# Altium schematic sheet EnergyHarvestingBoard.SchDoc
size A2; SheetNumber: 1; SheetTotal: 1
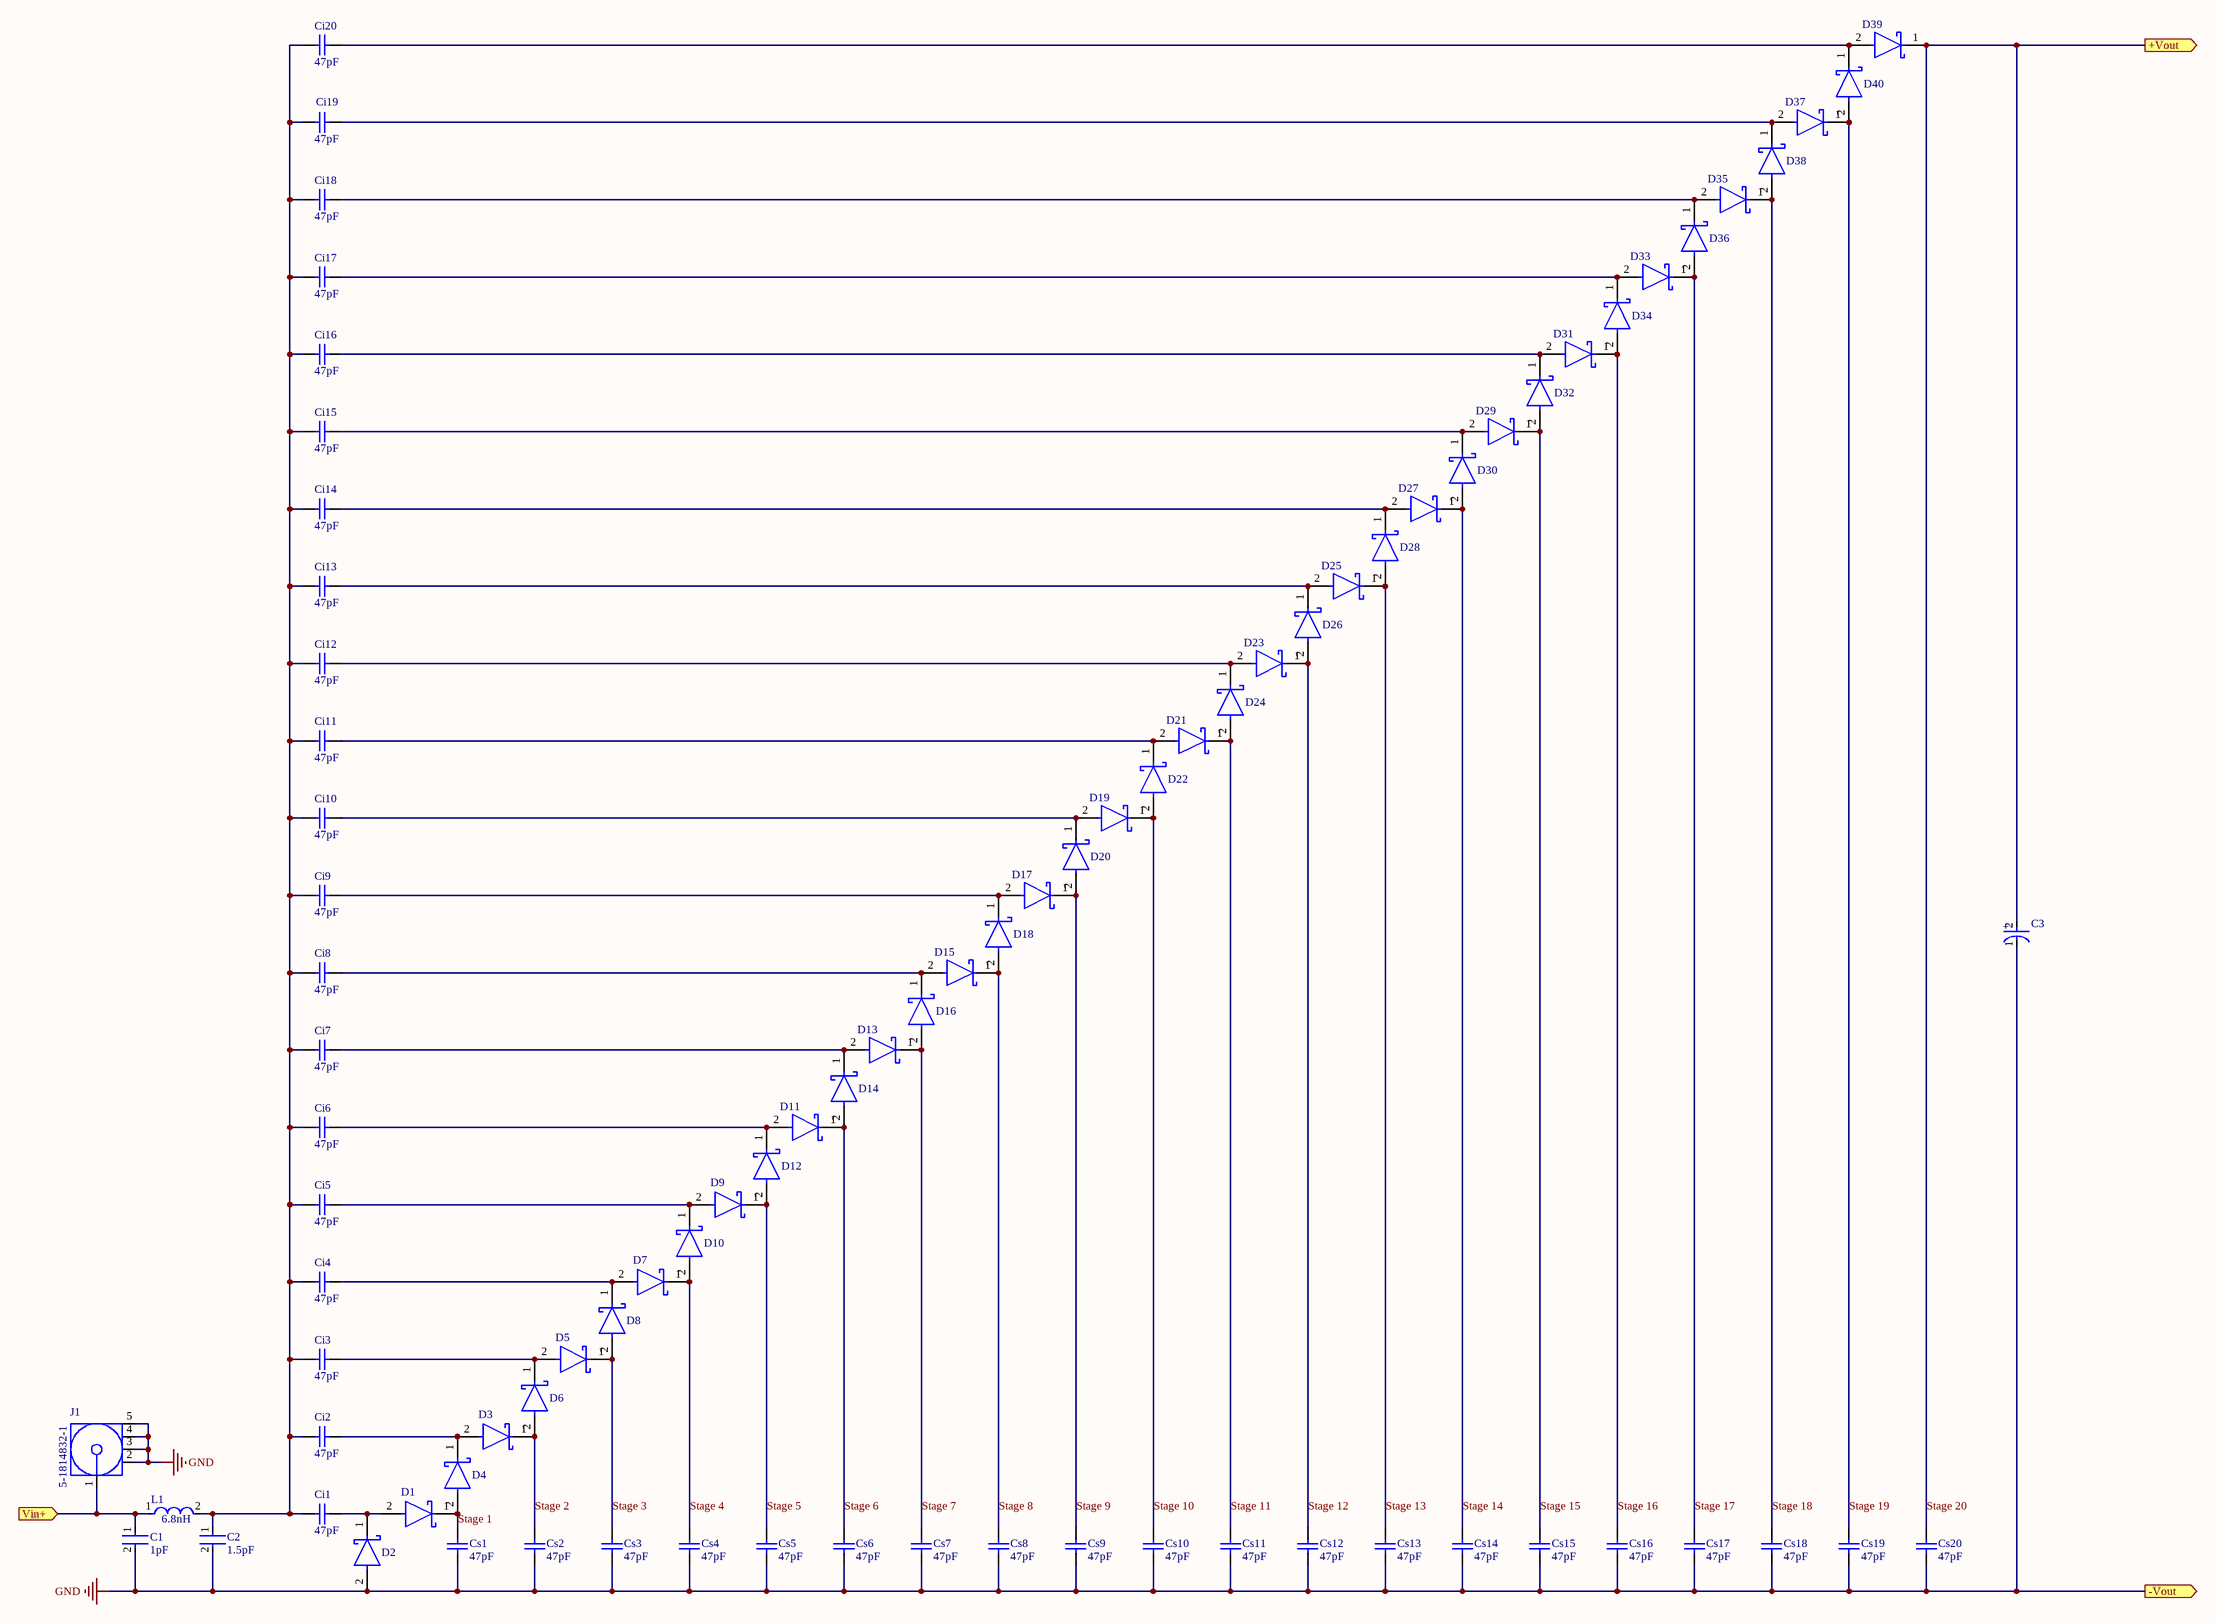
[diagram p0: EnergyHarvestingBoard.SchDoc]

## Parts
C1  1pF  [FP-CBR04C-MFG]
C2  1.5pF  [FP-CBR04C-MFG]
C3  EEUEB1JR47S  [FP-RAD-TH-D_5_0_5-L_11_1-MFG]  (value not drawn)
Ci1  47pF  [CAPC1005X56X25NL10T15]
Ci2  47pF  [CAPC1005X56X25NL10T15]
Ci3  47pF  [CAPC1005X56X25NL10T15]
Ci4  47pF  [CAPC1005X56X25NL10T15]
Ci5  47pF  [CAPC1005X56X25NL10T15]
Ci6  47pF  [CAPC1005X56X25NL10T15]
Ci7  47pF  [CAPC1005X56X25NL10T15]
Ci8  47pF  [CAPC1005X56X25NL10T15]
Ci9  47pF  [CAPC1005X56X25NL10T15]
Ci10  47pF  [CAPC1005X56X25NL10T15]
Ci11  47pF  [CAPC1005X56X25NL10T15]
Ci12  47pF  [CAPC1005X56X25NL10T15]
Ci13  47pF  [CAPC1005X56X25NL10T15]
Ci14  47pF  [CAPC1005X56X25NL10T15]
Ci15  47pF  [CAPC1005X56X25NL10T15]
Ci16  47pF  [CAPC1005X56X25NL10T15]
Ci17  47pF  [CAPC1005X56X25NL10T15]
Ci18  47pF  [CAPC1005X56X25NL10T15]
Ci19  47pF  [CAPC1005X56X25NL10T15]
Ci20  47pF  [CAPC1005X56X25NL10T15]
Cs1  47pF  [CAPC1005X56X25NL10T15]
Cs2  47pF  [CAPC1005X56X25NL10T15]
Cs3  47pF  [CAPC1005X56X25NL10T15]
Cs4  47pF  [CAPC1005X56X25NL10T15]
Cs5  47pF  [CAPC1005X56X25NL10T15]
Cs6  47pF  [CAPC1005X56X25NL10T15]
Cs7  47pF  [CAPC1005X56X25NL10T15]
Cs8  47pF  [CAPC1005X56X25NL10T15]
Cs9  47pF  [CAPC1005X56X25NL10T15]
Cs10  47pF  [CAPC1005X56X25NL10T15]
Cs11  47pF  [CAPC1005X56X25NL10T15]
Cs12  47pF  [CAPC1005X56X25NL10T15]
Cs13  47pF  [CAPC1005X56X25NL10T15]
Cs14  47pF  [CAPC1005X56X25NL10T15]
Cs15  47pF  [CAPC1005X56X25NL10T15]
Cs16  47pF  [CAPC1005X56X25NL10T15]
Cs17  47pF  [CAPC1005X56X25NL10T15]
Cs18  47pF  [CAPC1005X56X25NL10T15]
Cs19  47pF  [CAPC1005X56X25NL10T15]
Cs20  47pF  [CAPC1005X56X25NL10T15]
D1  CDBQR0130L  [FP-0402-SOD-923F-MFG]  (value not drawn)
D2  CDBQR0130L  [FP-0402-SOD-923F-MFG]  (value not drawn)
D3  CDBQR0130L  [FP-0402-SOD-923F-MFG]  (value not drawn)
D4  CDBQR0130L  [FP-0402-SOD-923F-MFG]  (value not drawn)
D5  CDBQR0130L  [FP-0402-SOD-923F-MFG]  (value not drawn)
D6  CDBQR0130L  [FP-0402-SOD-923F-MFG]  (value not drawn)
D7  CDBQR0130L  [FP-0402-SOD-923F-MFG]  (value not drawn)
D8  CDBQR0130L  [FP-0402-SOD-923F-MFG]  (value not drawn)
D9  CDBQR0130L  [FP-0402-SOD-923F-MFG]  (value not drawn)
D10  CDBQR0130L  [FP-0402-SOD-923F-MFG]  (value not drawn)
D11  CDBQR0130L  [FP-0402-SOD-923F-MFG]  (value not drawn)
D12  CDBQR0130L  [FP-0402-SOD-923F-MFG]  (value not drawn)
D13  CDBQR0130L  [FP-0402-SOD-923F-MFG]  (value not drawn)
D14  CDBQR0130L  [FP-0402-SOD-923F-MFG]  (value not drawn)
D15  CDBQR0130L  [FP-0402-SOD-923F-MFG]  (value not drawn)
D16  CDBQR0130L  [FP-0402-SOD-923F-MFG]  (value not drawn)
D17  CDBQR0130L  [FP-0402-SOD-923F-MFG]  (value not drawn)
D18  CDBQR0130L  [FP-0402-SOD-923F-MFG]  (value not drawn)
D19  CDBQR0130L  [FP-0402-SOD-923F-MFG]  (value not drawn)
D20  CDBQR0130L  [FP-0402-SOD-923F-MFG]  (value not drawn)
D21  CDBQR0130L  [FP-0402-SOD-923F-MFG]  (value not drawn)
D22  CDBQR0130L  [FP-0402-SOD-923F-MFG]  (value not drawn)
D23  CDBQR0130L  [FP-0402-SOD-923F-MFG]  (value not drawn)
D24  CDBQR0130L  [FP-0402-SOD-923F-MFG]  (value not drawn)
D25  CDBQR0130L  [FP-0402-SOD-923F-MFG]  (value not drawn)
D26  CDBQR0130L  [FP-0402-SOD-923F-MFG]  (value not drawn)
D27  CDBQR0130L  [FP-0402-SOD-923F-MFG]  (value not drawn)
D28  CDBQR0130L  [FP-0402-SOD-923F-MFG]  (value not drawn)
D29  CDBQR0130L  [FP-0402-SOD-923F-MFG]  (value not drawn)
D30  CDBQR0130L  [FP-0402-SOD-923F-MFG]  (value not drawn)
D31  CDBQR0130L  [FP-0402-SOD-923F-MFG]  (value not drawn)
D32  CDBQR0130L  [FP-0402-SOD-923F-MFG]  (value not drawn)
D33  CDBQR0130L  [FP-0402-SOD-923F-MFG]  (value not drawn)
D34  CDBQR0130L  [FP-0402-SOD-923F-MFG]  (value not drawn)
D35  CDBQR0130L  [FP-0402-SOD-923F-MFG]  (value not drawn)
D36  CDBQR0130L  [FP-0402-SOD-923F-MFG]  (value not drawn)
D37  CDBQR0130L  [FP-0402-SOD-923F-MFG]  (value not drawn)
D38  CDBQR0130L  [FP-0402-SOD-923F-MFG]  (value not drawn)
D39  CDBQR0130L  [FP-0402-SOD-923F-MFG]  (value not drawn)
D40  CDBQR0130L  [FP-0402-SOD-923F-MFG]  (value not drawn)
J1  5-1814832-1  [TECO-5-1814832-1_V]
L1  6.8nH  [FP-LQW18AN_00-MFG]

## Ports
+Vout (out), -Vout (out), Vin+ (in)

## Nets
GND: C1.2 C2.2 C3.1(C) Cs1.2 Cs2.2 Cs3.2 Cs4.2 Cs5.2 Cs6.2 Cs7.2 Cs8.2 Cs9.2 Cs10.2 Cs11.2 Cs12.2 Cs13.2 Cs14.2 Cs15.2 Cs16.2 Cs17.2 Cs18.2 Cs19.2 Cs20.2 D2.2(A) J1.2 J1.3 J1.4 J1.5 ; port -Vout
Stage 1: Cs1.1 D1.1(C) D4.2(A)
Stage 2: Cs2.1 D3.1(C) D6.2(A)
Stage 3: Cs3.1 D5.1(C) D8.2(A)
Stage 4: Cs4.1 D7.1(C) D10.2(A)
Stage 5: Cs5.1 D9.1(C) D12.2(A)
Stage 6: Cs6.1 D11.1(C) D14.2(A)
Stage 7: Cs7.1 D13.1(C) D16.2(A)
Stage 8: Cs8.1 D15.1(C) D18.2(A)
Stage 9: Cs9.1 D17.1(C) D20.2(A)
Stage 10: Cs10.1 D19.1(C) D22.2(A)
Stage 11: Cs11.1 D21.1(C) D24.2(A)
Stage 12: Cs12.1 D23.1(C) D26.2(A)
Stage 13: Cs13.1 D25.1(C) D28.2(A)
Stage 14: Cs14.1 D27.1(C) D30.2(A)
Stage 15: Cs15.1 D29.1(C) D32.2(A)
Stage 16: Cs16.1 D31.1(C) D34.2(A)
Stage 17: Cs17.1 D33.1(C) D36.2(A)
Stage 18: Cs18.1 D35.1(C) D38.2(A)
Stage 19: Cs19.1 D37.1(C) D40.2(A)
Stage 20: C3.2(A) Cs20.1 D39.1(C) ; port +Vout
Vin+: C1.1 J1.1 L1.1 ; port Vin+
NetC2_1: C2.1 Ci1.1 Ci2.1 Ci3.1 Ci4.1 Ci5.1 Ci6.1 Ci7.1 Ci8.1 Ci9.1 Ci10.1 Ci11.1 Ci12.1 Ci13.1 Ci14.1 Ci15.1 Ci16.1 Ci17.1 Ci18.1 Ci19.1 Ci20.1 L1.2
NetCi1_2: Ci1.2 D1.2(A) D2.1(C)
NetCi2_2: Ci2.2 D3.2(A) D4.1(C)
NetCi3_2: Ci3.2 D5.2(A) D6.1(C)
NetCi4_2: Ci4.2 D7.2(A) D8.1(C)
NetCi5_2: Ci5.2 D9.2(A) D10.1(C)
NetCi6_2: Ci6.2 D11.2(A) D12.1(C)
NetCi7_2: Ci7.2 D13.2(A) D14.1(C)
NetCi8_2: Ci8.2 D15.2(A) D16.1(C)
NetCi9_2: Ci9.2 D17.2(A) D18.1(C)
NetCi10_2: Ci10.2 D19.2(A) D20.1(C)
NetCi11_2: Ci11.2 D21.2(A) D22.1(C)
NetCi12_2: Ci12.2 D23.2(A) D24.1(C)
NetCi13_2: Ci13.2 D25.2(A) D26.1(C)
NetCi14_2: Ci14.2 D27.2(A) D28.1(C)
NetCi15_2: Ci15.2 D29.2(A) D30.1(C)
NetCi16_2: Ci16.2 D31.2(A) D32.1(C)
NetCi17_2: Ci17.2 D33.2(A) D34.1(C)
NetCi18_2: Ci18.2 D35.2(A) D36.1(C)
NetCi19_2: Ci19.2 D37.2(A) D38.1(C)
NetCi20_2: Ci20.2 D39.2(A) D40.1(C)

## Notes on the sheet
- (in symbol CMP-05427-001047-1) +

## Library data of the parts
C1 = CMP-03020-014457-1: CAP CER 1PF 100V C0G/NP0 0402; Manufacturer Part Number: CBR04C109B1GAC; Manufacturer: KEMET; Material: Ceramic; Capacitance: 1.0 pF; Temperature Coefficient: 30ppm/°C; Temperature Characteristic: C0G; Tolerance: 0.1 pF; Value: 1.0 pF; Description: CBR0402 1.0 pF 30ppm/°C 0.1 pF C0G 100 V; Voltage Rating: 100 V; Device Class L1: Passive Components; RoHS: TRUE; Height: 0.55mm; Ipc Land Pattern Name: CAPC10050X50; ComponentLink2Description: Datasheet; Temperature: -55°C to +125°C; Lead Free: Yes; Device Class L2: Capacitors; Device Class L3: Ceramic Capacitors; Category: Cap; Octopart: https://octopart.com/cbr04c109b1gac-kemet-23816354; Digikey Description: CAP CER 1PF 100V C0G/NP0 0402; Temperature Range Low: -55°C; Automotive: No; Temperature Range High: +125°C; ComponentLink2URL: https://content.kemet.com/datasheets/KEM_C1030_CBR_SMD.pdf; Package: CBR04C; Mouser Description: Cap Ceramic 1pF 100V C0G 0.1pF Pad SMD 0402 125C Medical T/R
C2 = CMP-03020-033608-1: CAP CER 1.5PF 100V C0G/NP0 0402; Manufacturer Part Number: CBR04C159B1GAC; Manufacturer: KEMET; Description: CBR0402 1.5 pF 30ppm/°C 0.1 pF C0G 100 V; Tolerance: 0.1 pF; Material: Ceramic; Temperature Characteristic: C0G; Temperature Coefficient: 30ppm/°C; RoHS: TRUE; Height: 0.55mm; Octopart: https://octopart.com/cbr04c159b1gac-kemet-23816356; Package: CBR04C; Device Class L3: Ceramic Capacitors; Capacitance: 1.5 pF; Lead Free: Yes; Ipc Land Pattern Name: CAPC10050X50; ComponentLink2Description: Datasheet; Temperature Range High: +125°C; Automotive: No; Value: 1.5 pF; Temperature: -55°C to +125°C; Temperature Range Low: -55°C; ComponentLink2URL: https://content.kemet.com/datasheets/KEM_C1030_CBR_SMD.pdf; Device Class L1: Passive Components; Voltage Rating: 100 V; Digikey Description: CAP CER 1.5PF 100V C0G/NP0 0402; Category: Cap; Device Class L2: Capacitors
C3 = CMP-05427-001047-1: Aluminum Electrolytic Capacitors (Radial Lead Type) 0.47uF ±20% 63V; Life (Hours): 5000Hour; Ripple Current: 4.5mA; Lead Diameter: 0.5mm; Leakage Current: 3uA; Capacitance: 470nF; Polarity: Polar; Construction: RADIAL; Number of Pins: 2; Tolerance: 20%; Series: EB; Voltage Rating: 63V; Min Operating Temperature: -40°C; Lead Pitch: 2mm; Termination: Radial; Voltage Rating (DC): 63V; Package Quantity: 200; REACH SVHC: No SVHC; Length: 11mm; Ripple Current (AC): 4.5mA; Height - Seated (Max): 0.433inch; Diameter: 5mm; Height: 11mm; Lead Free: Lead Free; RoHS Compliant: Yes; Mount: Through Hole; Voltage: 63V; Radiation Hardening: No; Packaging: Bulk; Max Operating Temperature: 105°C; Case/Package: Radial
Ci1-Ci20 Cs1-Cs20 = CMP-2008-02783-1: Part Number: 0402YA470KAT2A; Manufacturer: AVX Interconnect / Elco
D1-D40 = CMP-20227-000005-1: DIODE SCHOTTKY 30V 100MA 0402; Max Surge Current: 1A; Max Reverse Leakage Current: 10uA; Packaging: Tape and Reel; Case Code (Imperial): 0402; Package Quantity: 1; Case Code (Metric): 1005; Max Reverse Voltage (DC): 30V; Mount: Surface Mount; Average Rectified Current: 100mA; Case/Package: 0402
J1 = CMP-2000-05415-1: SMA Connector, Pitch 5.08 mm, 1 Position, Height 9.5 mm, Tail Length 4 mm, -65 to 165 degC, RoHS, Bulk; Manufacturer: TE Connectivity; Connector Mounting: PCBMount; Connector Body Style: StraightJack; Impedance: 50ohm; Coaxial Termination: Solder; SVHC: NoSVHC(15-Jun-2015); Frequency Max: 3GHz; Product Range: ZDCSeries; Connector Type: SMACoaxial; Datasheet Version: Rev. B1, 03/2011; Package Reference: 5-1814832-1; Package Description: SMA Connector, Pitch 5.08 mm, 1 Position, Height 9.5 mm, Tail Length 4 mm; Contact Plating: GoldPlatedContacts; Coaxial Cable Types: -; Contact Material: BerylliumCopper; Manufacturer URL: http://www.te.com/; Datasheet URL: http://www.onlinecomponents.com/productFiles/mf-AMP/eng_cd_1814832_a.pdf
L1 = CMP-06042-000801-1: Wire Wound RF Inductor 6.8nH ±0.5nH 750mA 0.082Ω 0603 (1608); Q Factor: 35; DC Resistance (DCR): 82mR; Self Resonant Frequency: 6GHz; Shielding: Unshielded; Core Material: Non-Magnetic; Test Frequency: 100MHz; Depth: 1mm; Military Standard: Not; Mount: Surface Mount; Case Code (Imperial): 0603; Package Quantity: 4000; Case/Package: 0603; Height - Seated (Max): 0.039inch; Min Operating Temperature: -55°C; Case Code (Metric): 1608; Termination: SMD/SMT; Resistor Type: Wirewound; DC Current: 750mA; Radiation Hardening: No; Inductance: 6.8nH; Max Operating Temperature: 125°C; Packaging: Tape and Reel; Series Resistance: 82mR; Height: 0.8mm; Current Rating: 750mA; Max DC Current: 750mA; Width: 0.031inch; Lead Free: Lead Free; Length: 1.6mm; Weight: 0.000106oz